# Altium schematic sheet Vaccum_Pump_Driver.SchDoc
size A4; SheetNumber: 4; SheetTotal: 5
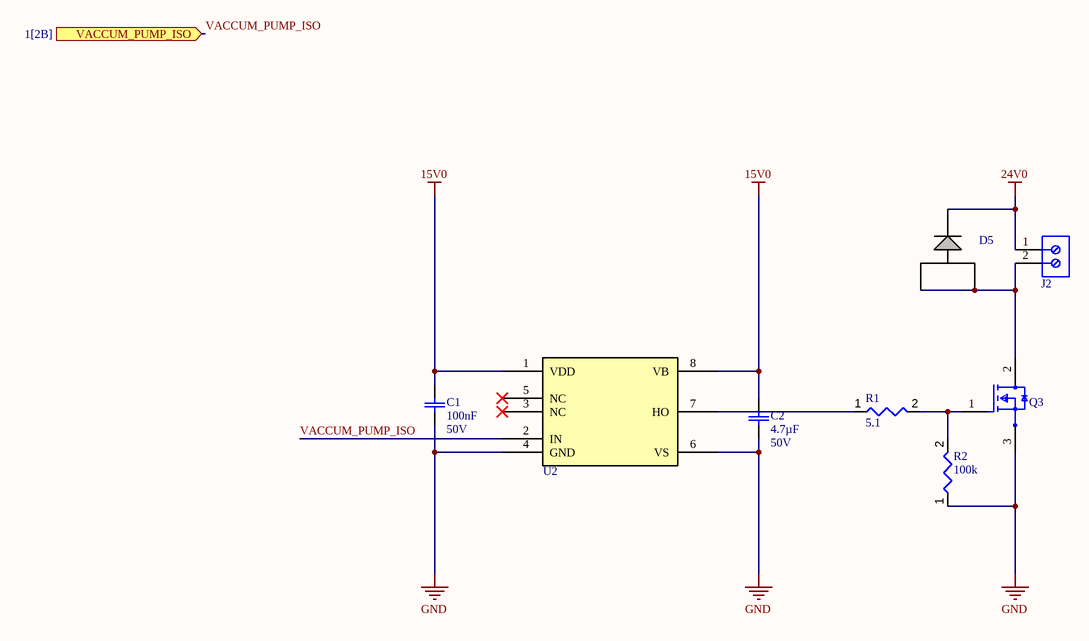
[diagram p0: Vaccum_Pump_Driver.SchDoc]

## Parts
C1  value 100nF  Voltage Rating: 50V  [Generic Ceramic 0603 CAP]  (hidden comment: CAP-MLCC_SMD-0603_MR-GCM_u_0.1uF_50V_10%_X8L)
C2  value 4.7µF  Voltage Rating: 50V  [Generic Ceramic 0805 CAP]  (hidden comment: CAP-MLCC_SMD-0805_TDK-CGA_u_4.7uF_V_10%_X8R)
D5  STPS1045B  [STPS1045B-Footprint-1]  (value not drawn)
J2  691137710002  [691137710002]  (value not drawn)
Q3  STD7NM50N  [STD7NM50N-Footprint-1]  (value not drawn)
R1  value 5.1  [Generic_0805_RES]  (hidden comment: RES-TK_SMD-0805_VIS-CRCW_R_5.1R_1/10W_1%)
R2  value 100k  [Generic_0805_RES]  (hidden comment: RES-TK_SMD-0805_VIS-CRCW_K_100K_1/8W_1%)
U2  fan73711  [fan73711-Footprint-1]  (value not drawn)

## Ports
VACCUM_PUMP_ISO (in, see 1[2B])

## Nets
15V0: C1.2 C2.2 U2.1(VDD) U2.8(VB)
24V0: D5.3 J2.1
GND: C1.1 C2.1 Q3.3 R2.1 U2.4(GND) U2.6(VS)
VACCUM_PUMP_ISO: U2.2(IN) ; port VACCUM_PUMP_ISO
NetD5_1: D5.1 D5.2 J2.2 Q3.2
NetQ3_1: Q3.1 R1.2 R2.2
NetR1_1: R1.1 U2.7(HO)

Not connected (* = marked no-connect by the designer): U2 3(NC)* 5(NC)*

## Library data of the parts
C1 = CMP-001-00115-11: Ceramic Capacitor, Multilayer, Ceramic, 50V, 10% +Tol, 10% -Tol, X8L, -40/+15% TC, 0.1uF, Surface Mount, 0603; Automotive: AEQ-200; Min Operating Temperature: -55°C; Case/Package: 0603; Mounting Technology: Surface Mount; RoHS Compliant: Yes; Capacitor Type: Ceramic; Pins: 2; Max Operating Temperature: 150°C
C2 = CMP-001-00158-2: Ceramic Capacitor, Multilayer, Ceramic, 50V, 10% +Tol, 10% -Tol, X5R, 15% TC, 4.7uF, Surface Mount, 0805; Tolerance: 10%; Max Operating Temperature: 85°C; Case/Package: 0805; RoHS Compliant: Yes; Automotive: AEQ-Q200; Mounting Technology: Surface Mount; Capacitor Type: Ceramic; Pins: 2; Dielectric: x5r; Min Operating Temperature: -55°C
D5 = CMP-001-0199-1: Rectifier Diode, Schottky, 1 Phase, 1 Element, 10A, 45V V(RRM), Silicon, TO-252AA; Max Reverse Leakage Current: 100µA; Forward Voltage: 570mV; Polarity: Standard; Max Surge Current: 75A; Element Configuration: Common Anode; Number of Elements: 1; Max Junction Temperature (Tj): 175°C; Current Rating: 10A; Radiation Hardening: No; REACH SVHC: No; Min Operating Temperature: -65°C; Lifecycle Status: Production; China RoHS: Non-Compliant; Schedule B: 8541100080, 8541100080; Forward Current: 10A; Max Reverse Voltage (DC): 45V; Voltage Rating (DC): 45V; Output Current: 10A; Pins: 2; Number of Terminals: 2; Max Operating Temperature: 175°C; Max Output current: 10A; Mounting Technology: Surface Mount; Case/Package: DPAK; Max Repetitive Reverse Voltage (Vrrm): 45V; Average Rectified Current: 10A; Width: 6.2mm; Peak Reverse Current: 100µA; Length: 6.6mm; Lead Free: Lead Free; Peak Non-Repetitive Surge Current: 75A; Reverse Standoff Voltage: 45V; Height: 2.4mm; Max Forward Surge Current (Ifsm): 75A; RoHS: Compliant
J2 = CMP-001-0029-2: 2P Block Terminal; RoHS Compliant: Yes
Q3 = CMP-001-0178-1: N-channel 500V - 0.70 Ohm - 5A - TO-220 - TO-220FP - Ipak - Dpak; Gate to Source Voltage (Vgs): 25V; Max Power Dissipation: 45W; Turn-Off Delay Time: 40ns; Rise Time: 5ns; Drain to Source Resistance: 780mΩ; Element Configuration: Single; Number of Elements: 1; Input Capacitance: 400pF; Nominal Vgs: 3V; Value: 780mΩ; Fall Time: 9ns; Pins: 3; Min Operating Temperature: -55°C; Mounting Technology: Surface Mount; Max Operating Temperature: 150°C; Packaging: Cut Tape (CT); Drain to Source Breakdown Voltage: 500V; Drain to Source Voltage (Vdss): 500V; Min Breakdown Voltage: 500V; Lead Free: Lead Free; China RoHS: Non-Compliant; Rds On Max: 780mΩ; RoHS: Compliant; Lifecycle Status: Obsolete; Case/Package: TO-252-3; Power Dissipation: 45W; Continuous Drain Current (ID): 5A; Number of Terminals: 2; REACH SVHC: No
R1 = CMP-009-00244-4: Fixed Resistor, Metal Glaze/thick Film, 0.125W, 1ohm, 150V, 1% +/-Tol, 100ppm/Cel, Surface Mount, 0805; Voltage Rating: 75V; Power: 125mW; Pins: 2; Case/Package: 0805; Tolerance: 1%; Min Operating Temperature: -55°C; RoHS Compliant: Yes; Mounting Technology: Surface Mount; Max Operating Temperature: 155°C
R2 = CMP-009-00208-8: Fixed Resistor, Metal Glaze/thick Film, 0.125W, 100000ohm, 150V, 1% +/-Tol, 100ppm/Cel, Surface Mount, 0805; Power: 125mW; RoHS Compliant: Yes; Case/Package: 0805; Max Operating Temperature: 155°C; Mounting Technology: Surface Mount; Tolerance: 1%; Pins: 2; Min Operating Temperature: -55°C; Voltage Rating: 150V
U2 = CMP-001-0175-1: Tape & Reel (TR) FAN73711 High-Side 2009 gate driver 25ns 125C 4A 4A 625mW; Manufacturer Lifecycle Status: ACTIVE; Output Voltage: 1.2V; Number of Outputs: 1; Max Supply Current: 100µA; Turn-Off Delay Time: 150ns; Min Supply Voltage: 10V; Max Supply Voltage: 20V; Operating Supply Voltage: 15V; Nominal Supply Current: 35µA; Fall Time: 15ns; Max Junction Temperature (Tj): 150°C; Max Output current: 4A; Max Operating Temperature: 125°C; Power Dissipation: 625mW; REACH SVHC: Yes; Terminal Pitch: 1.27mm; Rise Time: 25ns; Length: 4.92mm; Radiation Hardening: No; Width: 3.95mm; Weight: 143mg; Turn-On Delay Time: 150ns; Packaging: Cut Tape; Max Power Dissipation: 625mW; Pins: 8; Number of Circuits: 1; Lifecycle Status: Production; Schedule B: 8542310000, 8542310000; Mounting Technology: Surface Mount; China RoHS: Compliant; RoHS: Compliant; Output Current: 4A; Lead Free: Lead Free; Number of Drivers: 1; Min Operating Temperature: -40°C; Propagation Delay: 150ns; Height - Seated (Max): 1.8mm; Number of Channels: 1; Height: 1.85mm; Ambient Temperature Range High: 125°C; Case/Package: SOP; Number of Terminals: 8